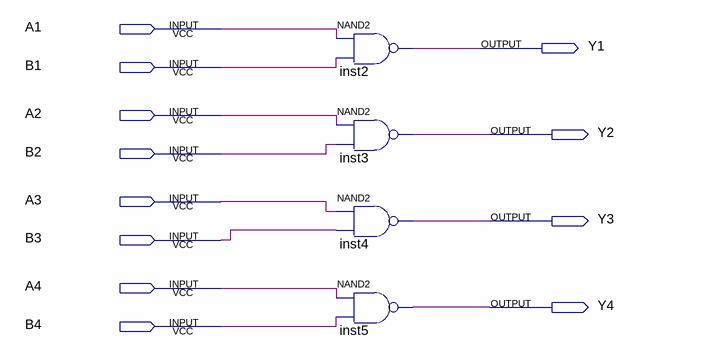
[diagram p0: schematic sheet]
// Quartus schematic ci7400.bdf as structural Verilog: 4 symbols, 12 pins
module ci7400 (
  input  A1,
  input  B1,
  input  A2,
  input  B2,
  input  A3,
  input  B3,
  input  A4,
  input  B4,
  output Y1,
  output Y2,
  output Y3,
  output Y4
);

  nand inst2 (Y1, A1, B1);
  nand inst3 (Y2, A2, B2);
  nand inst4 (Y3, A3, B3);
  nand inst5 (Y4, A4, B4);
endmodule
